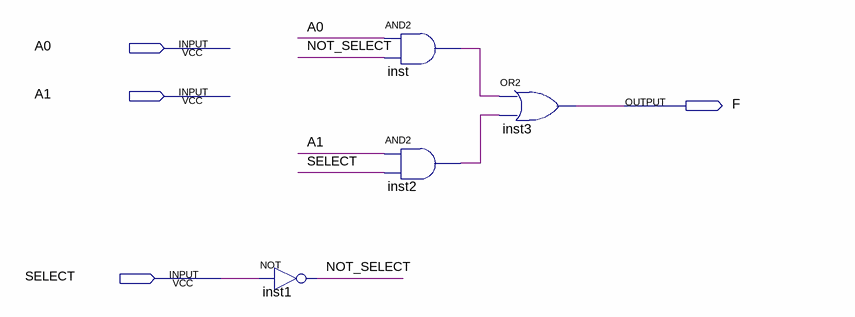
[diagram p0: schematic sheet]
// Quartus schematic MPX2_1.bdf as structural Verilog: 4 symbols, 4 pins
module MPX2_1 (
  input  A0,
  input  A1,
  input  SELECT,
  output F
);

  wire inst2_out, inst_out, NOT_SELECT;

  not inst1 (NOT_SELECT, SELECT);
  and inst (inst_out, A0, NOT_SELECT);
  and inst2 (inst2_out, A1, SELECT);
  or inst3 (F, inst_out, inst2_out);
endmodule
